# Altium schematic sheet Schematic.SchDoc
size 480 x 200 mm; SheetNumber: 1; SheetTotal: 1
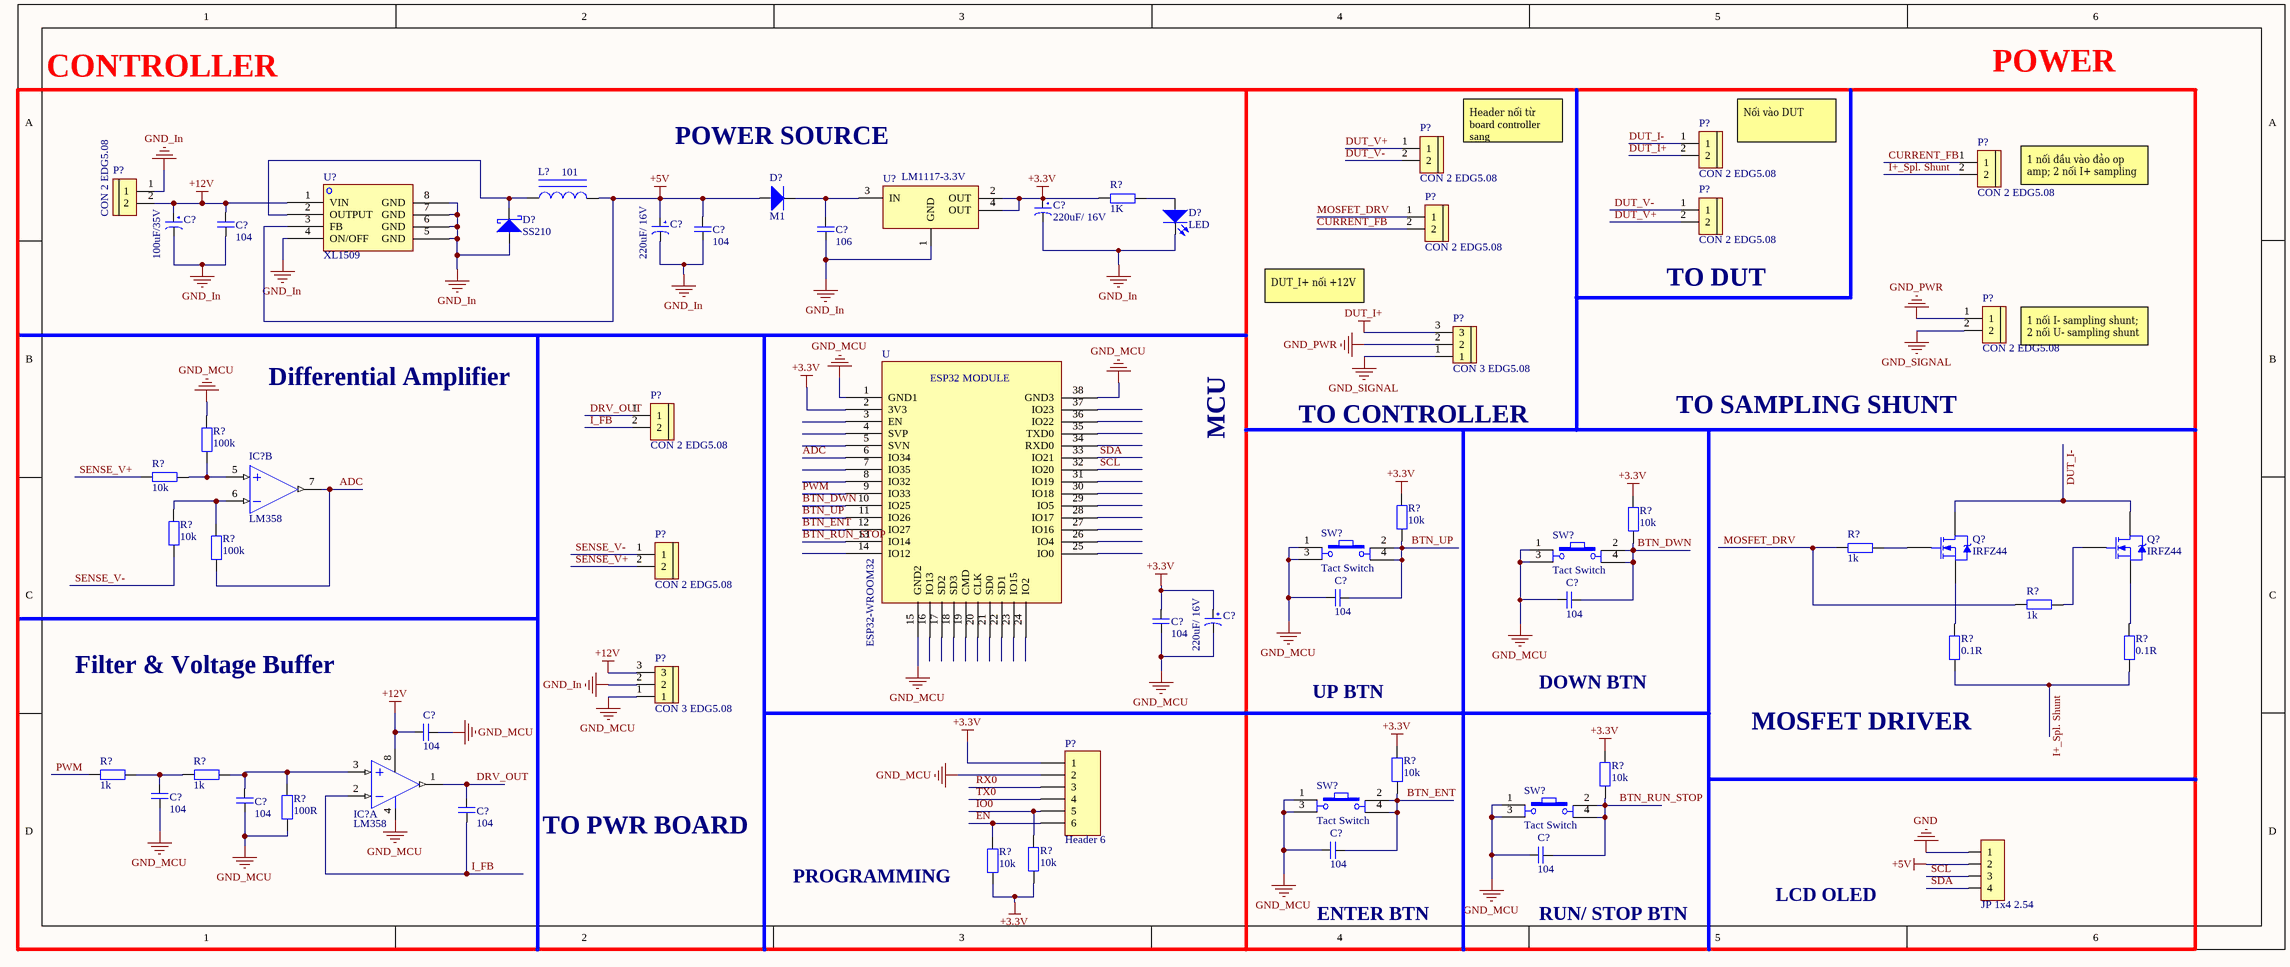
[diagram p0: Schematic.SchDoc]

## Parts
(Parts that share a designator on the sheet are numbered #1, #2 ... from top to bottom, then left to right.)
C?#1  220uF/ 16V  [CAP SMD ALUMINUM D8]
C?#2  100uF/35V  [CAP SMD ALUMINUM D8]
C?#3  104  [SM-0805]
C?#4  220uF/ 16V  [CAP SMD ALUMINUM D8]
C?#5  104  [SM-0805]
C?#6  106  [SM-0805]
C?#7  104  [SM-0805]
C?#8  104  [SM-0805]
C?#9  104  [SM-0805]
C?#10  220uF/ 16V  [CAP SMD ALUMINUM D8]
C?#11  104  [SM-0805]
C?#12  104  [SM-0805]
C?#13  104  [SM-0805]
C?#14  104  [SM-0805]
C?#15  104  [SM-0805]
C?#16  104  [SM-0805]
D?#1  M1  [DO-214AC]
D?#2  LED  [LED-3MM RED]
D?#3  SS210  [DO-214AC]
IC?#1  LM358  [SOIC 8/W150]  (part B of 2)
IC?#2  LM358  [SOIC 8/W150]  (part A of 2)
JP?  JP 1x4 2.54  [JP 1x4 CT]
L?  101  [INDUCTOR SMD 7342 7.3X7.3X4.2mm]
P?#1  CON 2 EDG5.08  [CON 2 2EDG5.08]
P?#2  CON 2 EDG5.08  [CON 2 2EDG5.08]
P?#3  CON 2 EDG5.08  [CON 2 2EDG5.08]
P?#4  CON 2 EDG5.08  [CON 2 2EDG5.08]
P?#5  CON 2 EDG5.08  [CON 2 2EDG5.08]
P?#6  CON 2 EDG5.08  [CON 2 2EDG5.08]
P?#7  CON 2 EDG5.08  [CON 2 2EDG5.08]
P?#8  CON 3 EDG5.08  [CON 3 3EDG5.08]
P?#9  CON 2 EDG5.08  [CON 2 2EDG5.08]
P?#10  CON 2 EDG5.08  [CON 2 2EDG5.08]
P?#11  CON 3 EDG5.08  [CON 3 3EDG5.08]
P?#12  Header 6  [HEADER 6PIN]
Q?#1  IRFZ44  [TO220]
Q?#2  IRFZ44  [TO220]
R?#1  1K  [RESISTOR SMD 0805]
R?#2  100k  [RESISTOR SMD 0805]
R?#3  10k  [RESISTOR SMD 0805]
R?#4  10k  [RESISTOR SMD 0805]
R?#5  10k  [RESISTOR SMD 0805]
R?#6  10k  [RESISTOR SMD 0805]
R?#7  100k  [RESISTOR SMD 0805]
R?#8  1k  [RESISTOR SMD 0805]
R?#9  1k  [RESISTOR SMD 0805]
R?#10  0.1R  [tro vach 2w]
R?#11  0.1R  [tro vach 2w]
R?#12  10k  [RESISTOR SMD 0805]
R?#13  1k  [RESISTOR SMD 0805]
R?#14  1k  [RESISTOR SMD 0805]
R?#15  10k  [RESISTOR SMD 0805]
R?#16  100R  [RESISTOR 1/4W]
R?#17  10k  [RESISTOR SMD 0805]
R?#18  10k  [RESISTOR SMD 0805]
SW?#1  Tact Switch  [Tact Switch 6X6]
SW?#2  Tact Switch  [Tact Switch 6X6]
SW?#3  Tact Switch  [Tact Switch 6X6]
SW?#4  Tact Switch  [Tact Switch 6X6]
U  ESP32-WROOM32  [ESP32-WROOM32]
U?#1  LM1117-3.3V  [SOT223-4N]
U?#2  XL1509  [SOP8]

## Nets
+3.3V: C?#1.1 C?#9.2 C?#10.1 P?#12.1 R?#1.1 R?#4.1 R?#5.1 R?#12.1 R?#15.1 R?#17.1 R?#18.1 U.2(3V3) U?#1.2(OUT) U?#1.4(OUT)
+5V: C?#4.1 C?#5.2 D?#1.1 JP?.2 L?.2 U?#2.3(FB)
+12V: C?#2.1 C?#3.2 C?#11.2 IC?#2.8(+V) P?#4.2 P?#11.3 U?#2.1(VIN)
DUT_I+: P?#1.2 P?#8.3
GND: JP?.1
GND_In: C?#1.2 C?#2.2 C?#3.1 C?#4.2 C?#5.1 C?#6.1 D?#2.2 D?#3.1 P?#4.1 P?#11.2 U?#1.1(GND) U?#2.4(ON/OFF) U?#2.5(GND) U?#2.6(GND) U?#2.7(GND) U?#2.8(GND)
GND_MCU: C?#7.2 C?#8.2 C?#9.1 C?#10.2 C?#11.1 C?#12.2 C?#13.2 C?#15.2 C?#16.2 IC?#2.4(-V) P?#11.1 P?#12.2 R?#2.2 R?#16.1 SW?#1.1 SW?#1.3 SW?#2.1 SW?#2.3 SW?#3.1 SW?#3.3 SW?#4.1 SW?#4.3 U.1(GND1) U.15(GND2) U.38(GND3)
GND_PWR: P?#7.1 P?#8.2
GND_SIGNAL: P?#7.2 P?#8.1
ADC: IC?#1.7(OUT) R?#7.1 U.6(IO34)
BTN_DWN: C?#8.1 R?#5.2 SW?#2.2 SW?#2.4 U.10(IO25)
BTN_ENT: C?#15.1 R?#12.2 SW?#3.2 SW?#3.4 U.12(IO27)
BTN_RUN_STOP: C?#16.1 R?#15.2 SW?#4.2 SW?#4.4 U.13(IO14)
BTN_UP: C?#7.1 R?#4.2 SW?#1.2 SW?#1.4 U.11(IO26)
CURRENT_FB: P?#3.1 P?#6.2
DRV_OUT: C?#14.1 IC?#2.1(OUT) P?#9.1
DUT_I-: P?#1.1 Q?#1.2(D) Q?#2.2(D)
DUT_V+: P?#2.1 P?#5.2
DUT_V-: P?#2.2 P?#5.1
EN: P?#12.6 R?#17.2
I+_Spl. Shunt: P?#3.2 R?#10.1 R?#11.1
I_FB: C?#14.2 IC?#2.2(IN-) P?#9.2
IO0: P?#12.5 R?#18.2
MOSFET_DRV: P?#6.1 R?#8.2 R?#9.1
PWM: R?#13.1 U.9(IO33)
RX0: P?#12.3
SCL: JP?.3 U.32(IO20)
SDA: JP?.4 U.33(IO21)
SENSE_V+: P?#10.2 R?#3.2
SENSE_V-: P?#10.1 R?#6.2
TX0: P?#12.4
NetC?#6_2: C?#6.2 D?#1.2 U?#1.3(IN)
NetC?#12_1: C?#12.1 R?#13.2 R?#14.1
NetC?#13_1: C?#13.1 IC?#2.3(IN+) R?#14.2 R?#16.2
NetD?#2_1: D?#2.1 R?#1.2
NetD?#3_2: D?#3.2 L?.1 U?#2.2(OUTPUT)
NetIC?#1_5: IC?#1.5(IN+) R?#2.1 R?#3.1
NetIC?#1_6: IC?#1.6(IN-) R?#6.1 R?#7.2
NetQ?#1_1: Q?#1.1(G) R?#8.1
NetQ?#1_3: Q?#1.3(S) R?#10.2
NetQ?#2_1: Q?#2.1(G) R?#9.2
NetQ?#2_3: Q?#2.3(S) R?#11.2

Not connected (* = marked no-connect by the designer): U 3(EN) 4(SVP) 5(SVN) 7(IO35) 8(IO32) 14(IO12) 16(IO13) 17(SD2) 18(SD3) 19(CMD) 20(CLK) 21(SD0) 22(SD1) 23(IO15) 24(IO2) 25(IO0) 26(IO4) 27(IO16) 28(IO17) 29(IO5) 30(IO18) 31(IO19) 34(RXD0) 35(TXD0) 36(IO22) 37(IO23)

## Notes on the sheet
- CONTROLLER
- POWER
- POWER SOURCE
- (near P?#2) Header nối từ board controller sang
- (near P?#1) Nối vào DUT
- (near P?#3) 1 nối đầu vào đảo op amp; 2 nối I+ sampling shunt
- DUT_I+ nối +12V
- (near P?#5) TO DUT
- (near P?#7) 1 nối I- sampling shunt;
  2 nối U- sampling shunt
- Differential Amplifier
- MCU
- (near P?#8) TO CONTROLLER
- TO SAMPLING SHUNT
- Filter & Voltage Buffer
- UP BTN
- DOWN BTN
- MOSFET DRIVER
- TO PWR BOARD
- PROGRAMMING
- LCD OLED
- ENTER BTN
- RUN/ STOP BTN
- (in symbol ESP32-WROOM32) ESP32 MODULE

## Library data of the parts
C?#1 C?#2 C?#4 C?#10 = Cap_Polar
C?#3 C?#5-C?#9 C?#11-C?#16 = Cap_Non-Polar
D?#1 = Diode Standard: Part Number: LED 3 ly Single Colour; Pricing: *
D?#2 = LED: LED Single; Value: LED 3 ly Single Colour
D?#3 = Diode Schottky: Part Number: LED 3 ly Single Colour; Pricing: *
IC?#1 IC?#2 = LM358: Low-Power Dual Operational Amplifier; Value: LM358
JP? = JP 1x4 2.54 Cai Thang: Cắm; Ten_Linh_Kien: Jump Đơn Cái 2.54MM 1x20P Thẳng; Don_Vi: Con; Ma_Hang: MH004006; Ghi_Chu: *; Kieu_Chan: *; Chung_Loai: Cắm
L? = Inductor Iron: Magnetic-Core Inductor; Value: 150 mH
P?#1-P?#7 P?#9 P?#10 = CON 2 EDG5.08: Cắm; Ten_Linh_Kien: CON 2 2EDG5.08-2P 5.08MM ( Xanh Cong); Ma_Hang: MH000759; Ghi_Chu: *; Don_Vi: Con; Kieu_Chan: *; Chung_Loai: Cắm
P?#8 P?#11 = CON 3 EDG5.08: Cắm; Ten_Linh_Kien: CON 3 2EDG5.08-3P 5.08MM ( Xanh Cong); Ma_Hang: MH000760; Ghi_Chu: *; Kieu_Chan: *; Don_Vi: Con; Chung_Loai: Cắm
P?#12 = Header 6: Header, 6-Pin; LatestRevisionDate: 17-Jul-2002; LatestRevisionNote: Re-released for DXP Platform.; Publisher: Altium Limited
Q?#1 Q?#2 = FET IRFZ44 DIP: TO-220
R?#1-R?#9 R?#12-R?#18 = Resistor
R?#10 R?#11 = Tro Vach 2W 5% 0.1R: Cắm; Don_Vi: Con; So_Chan: 2; Ten_Linh_Kien: Trở 5% 2w 0.1R; Ma_Hang: MH006178; Chung_Loai: Cắm; Kieu_Chan: *
SW?#1-SW?#4 = SW4: Value: Button chip 4 pin
U = ESP32-WROOM32: ESP32 MCU
U?#1 = LM1117: 800mA Low-Dropout Linear Regulator; Creator: Nguyen Ba Bien; Website: http://group3i.net
U?#2 = XL1509: IC power sop8